# EAGLE design Unified 4.24.22 (EAGLE 9.6.2)

## Sheet 1 of 4
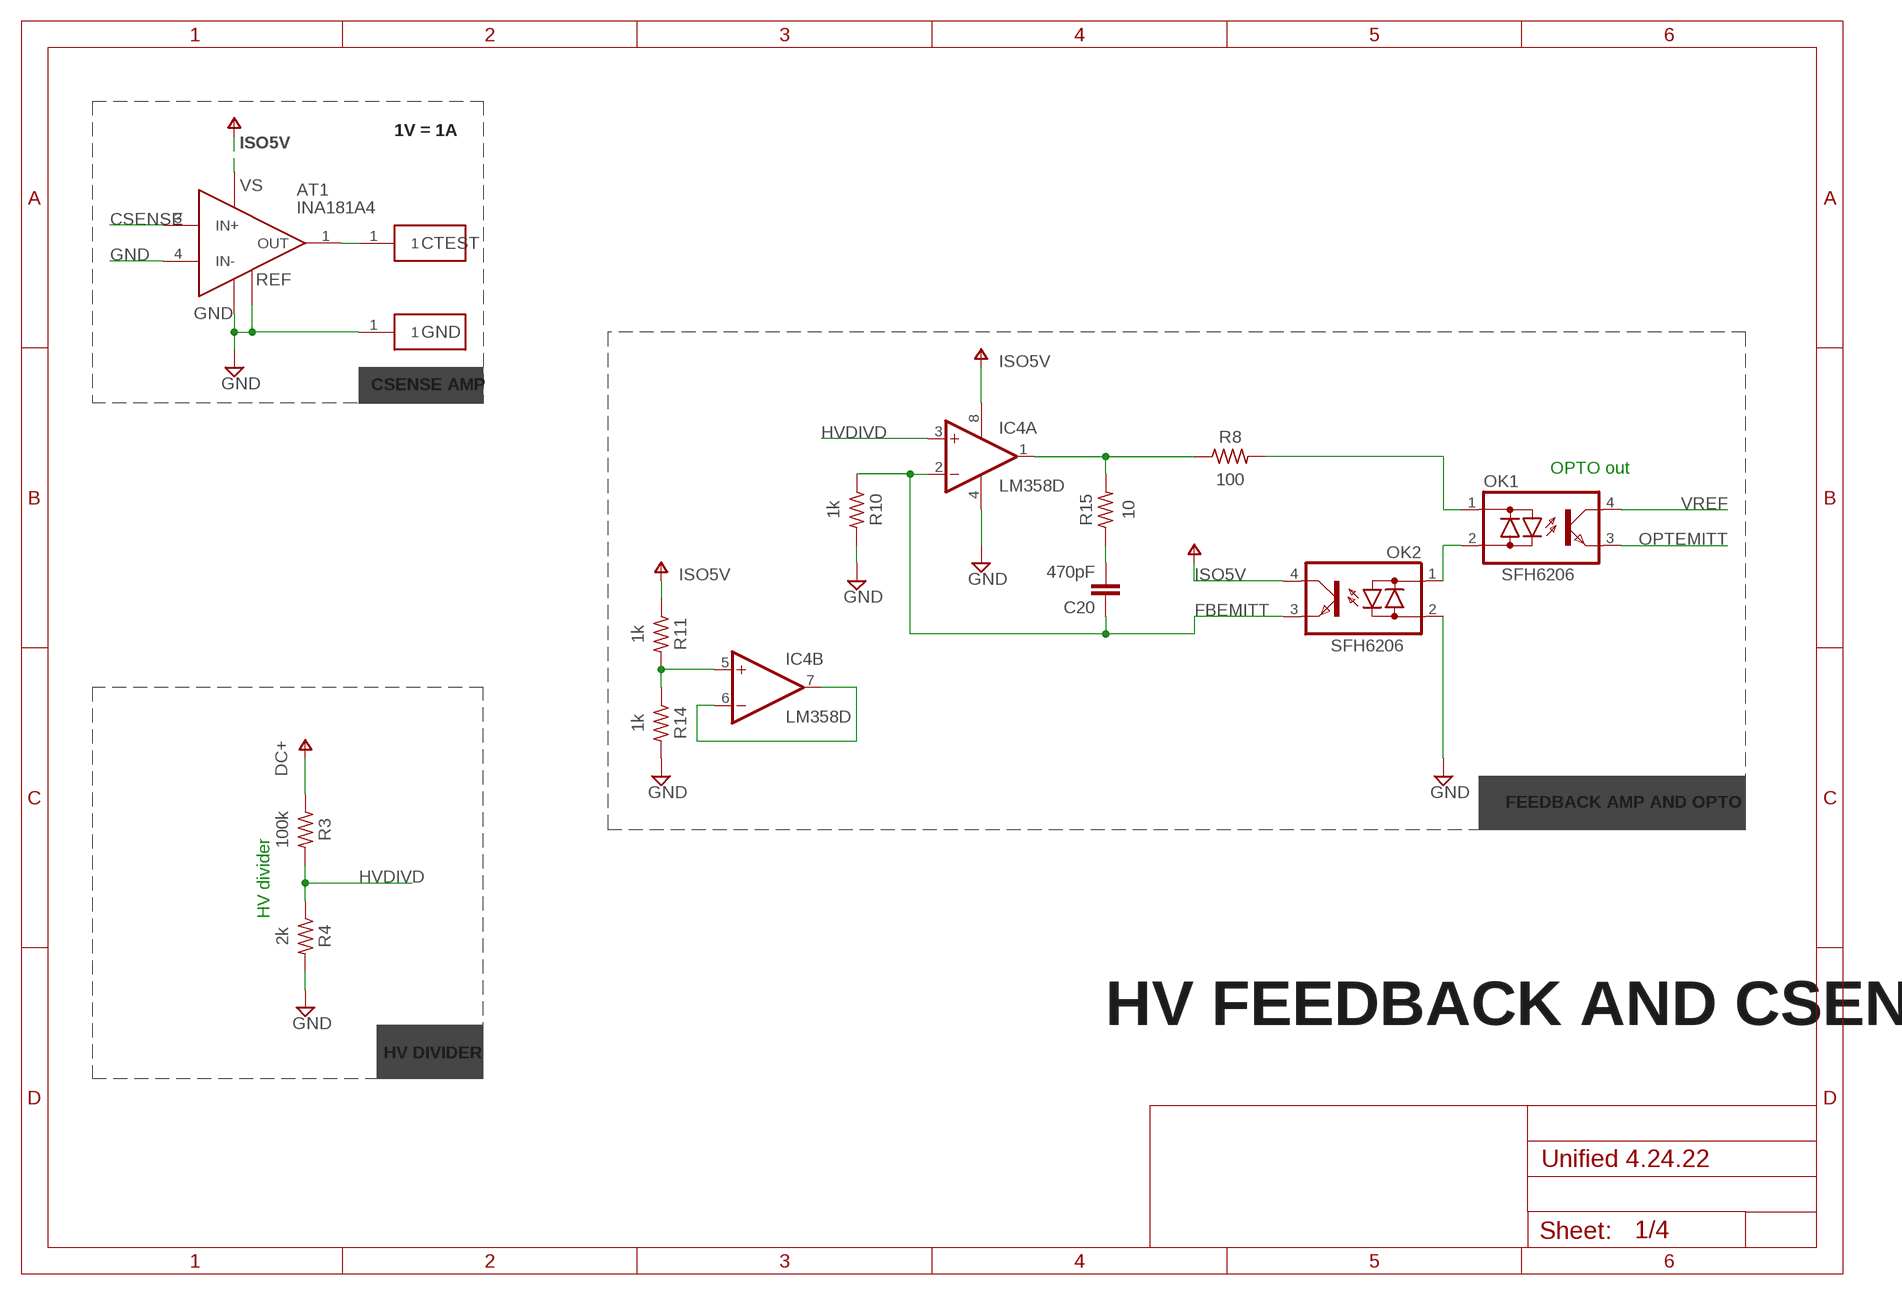
[diagram p0: schematic, sheet 1]

### Parts
AT1  INA181A4  INA181A3IDBVR  [SOT95P280X145-6N]
C20  470pF  C-EUC0805K  [C0805K]
CTEST  RCT-0C  [RCT-0C]
GND  RCT-0C  [RCT-0C]
IC4  LM358D  [SO08]
OK1  SFH6206  [DIL4-SMD]
OK2  SFH6206  [DIL4-SMD]
R3  100k  R-US_MELF0207R  [MINI_MELF-0207R]
R4  2k  R-US_R0805  [R0805]
R8  100  R-US_R0805  [R0805]
R10  1k  R-US_R0805  [R0805]
R11  1k  R-US_R0805  [R0805]
R14  1k  R-US_R0805  [R0805]
R15  10  R-US_R0805  [R0805]

### Nets
CSENSE: AT1.3(IN+) ; also sheet 2
DC+: R3.1 ; supply symbol labelled V+ ; also sheet 2
FBEMITT: C20.1 IC4.2(A:-IN) OK2.3(E) R10.1
GND: AT1.2(GND) AT1.4(IN-) AT1.5(REF) GND.1 IC4.4(P:V-) OK2.2(AC2) R4.2 R10.2 R14.2 ; also sheet 2,4
HVDIVD: IC4.3(A:+IN) R3.2 R4.1
ISO5V: AT1.6(VS) IC4.8(P:V+) OK2.4(C) R11.1 ; supply symbol labelled V+ ; also sheet 4
N$4: OK1.1(AC1) R8.2
N$6: OK1.2(AC2) OK2.1(AC1)
N$10: AT1.1(OUT) CTEST.1
N$18: IC4.5(B:+IN) R11.2 R14.1
N$20: IC4.1(A:OUT) R8.1 R15.2
N$21: IC4.6(B:-IN) IC4.7(B:OUT)
N$22: C20.2 R15.1
OPTEMITT: OK1.3(E) ; also sheet 3
VREF: OK1.4(C) ; also sheet 3

### Notes on the sheet
- 1V = 1A
- CSENSE AMP
- OPTO out
- FEEDBACK AMP AND OPTO
- HV divider
- HV FEEDBACK AND CSENSE
- HV DIVIDER

## Sheet 2 of 4
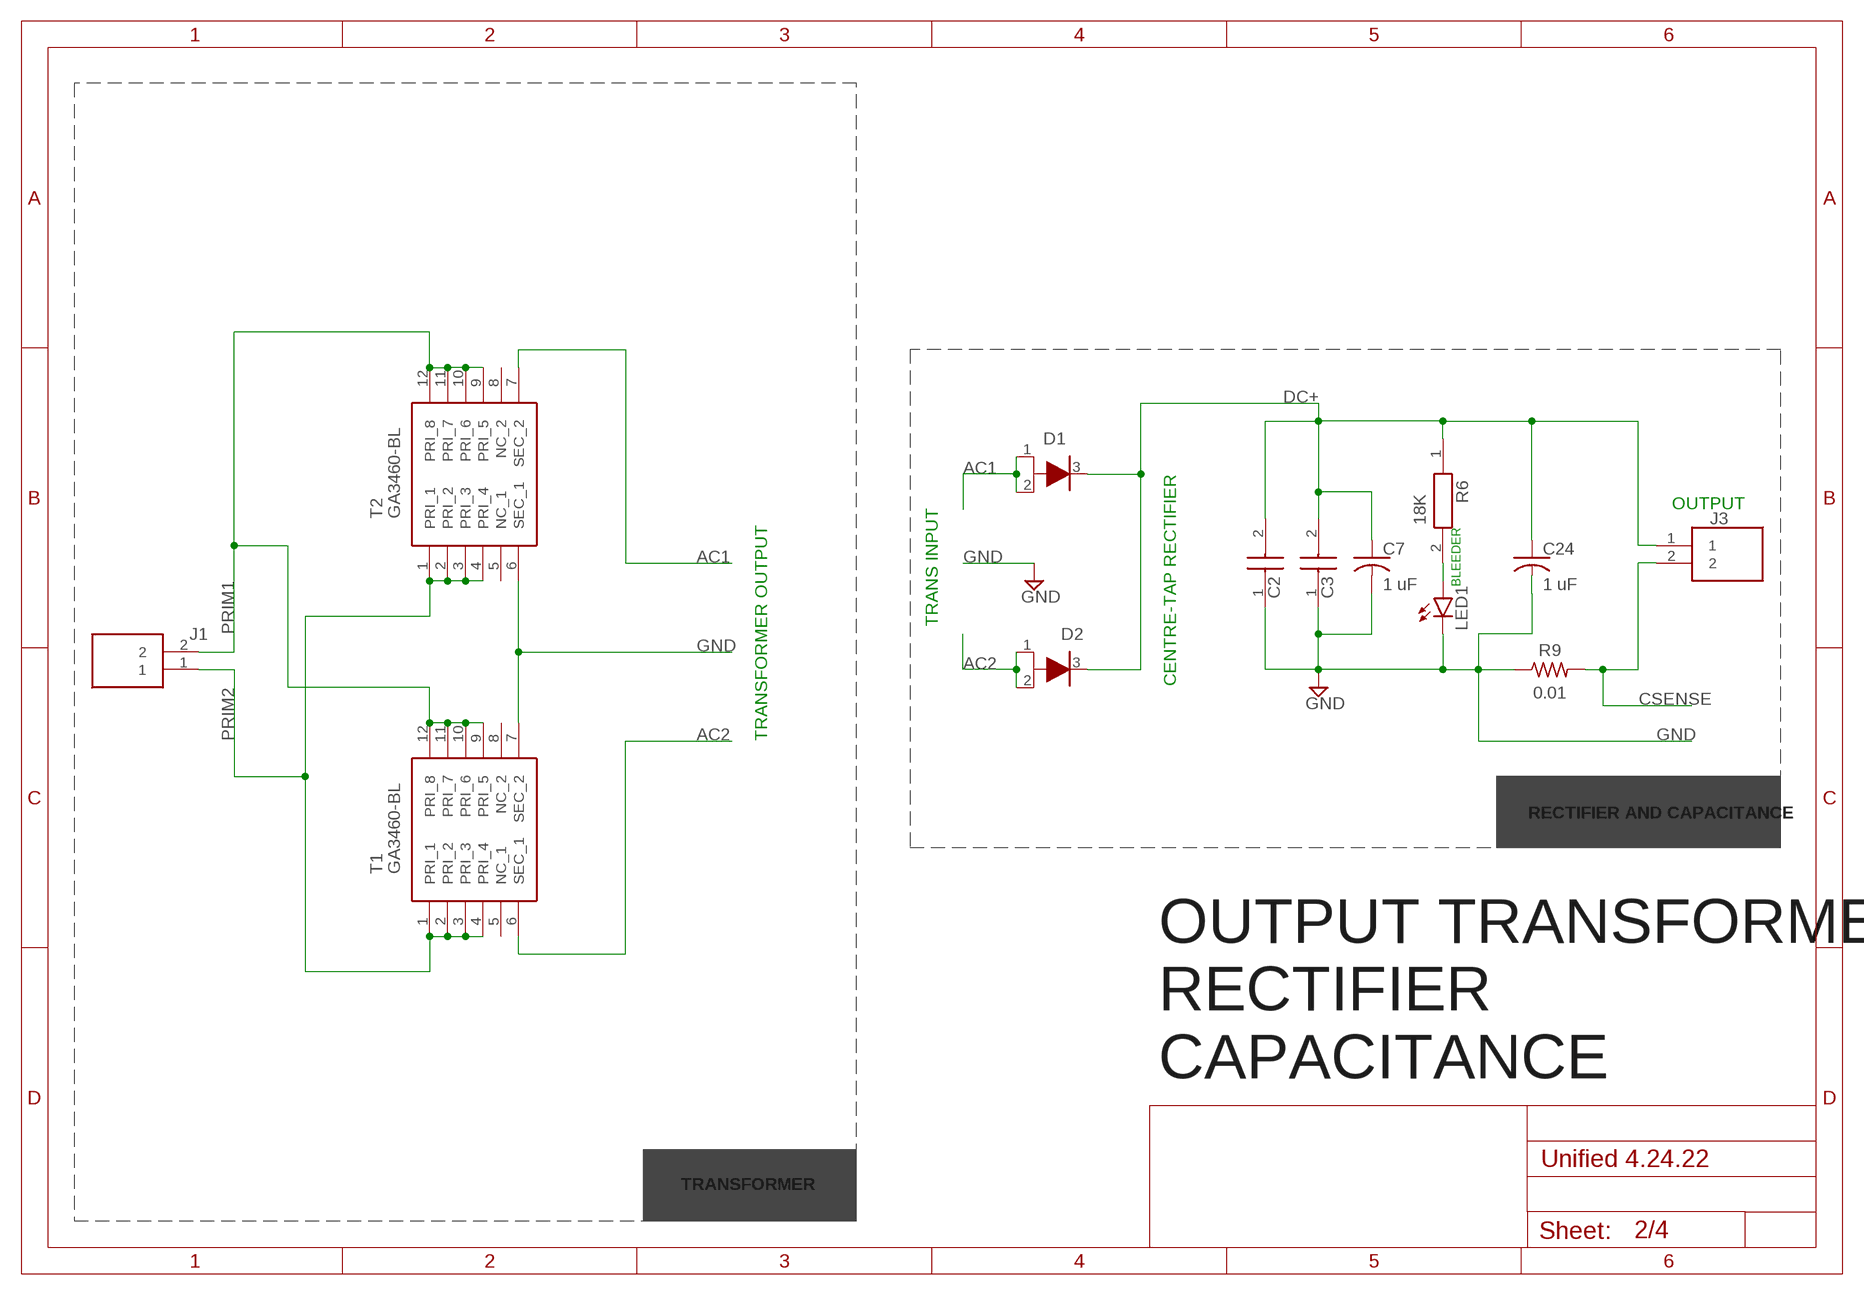
[diagram p1: schematic, sheet 2]

### Parts
C2  ELH227M400AS2AV  [CAPPRD1000W140D3000H3200]
C3  ELH227M400AS2AV  [CAPPRD1000W140D3000H3200]
C7  1 uF  C-USC1210K  [C1210K]
C24  1 uF  C-USC1210K  [C1210K]
D1  VS-16EDH02HM3_I  [V40DL45BPM3I]
D2  VS-16EDH02HM3_I  [V40DL45BPM3I]
J1  2305908-2  [23059082]
J3  2305908-2  [23059082]
LED1  LED5MM  [LED5MM]
R6  18K  MOS2CT52R183J  [RESAD3100W80L1500D400]
R9  0.01  R-US_CHIP-2512(6332-METRIC)  [RESC6332X71]
T1  GA3460-BL  [GA3460BL]
T2  GA3460-BL  [GA3460BL]

### Nets
AC1: D1.1(A_1) D1.2(A) T2.7(SEC_2)
AC2: D2.1(A_1) D2.2(A) T1.6(SEC_1)
CSENSE: J3.2 R9.2 ; also sheet 1
DC+: C2.2(-) C3.2(-) C7.1 C24.1 D1.3(K) D2.3(K) J3.1 R6.1 ; also sheet 1
GND: C2.1(+) C3.1(+) C7.2 C24.2 LED1.K(C) R9.1 T1.7(SEC_2) T2.6(SEC_1) ; also sheet 1,4
N$5: LED1.A R6.2
PRIM1: J1.2 T1.9(PRI_5) T1.10(PRI_6) T1.11(PRI_7) T1.12(PRI_8) T2.9(PRI_5) T2.10(PRI_6) T2.11(PRI_7) T2.12(PRI_8)
PRIM2: J1.1 T1.1(PRI_1) T1.2(PRI_2) T1.3(PRI_3) T1.4(PRI_4) T2.1(PRI_1) T2.2(PRI_2) T2.3(PRI_3) T2.4(PRI_4)
Unconnected: T1.5(NC_1) T1.8(NC_2) T2.5(NC_1) T2.8(NC_2)

### Notes on the sheet
- CENTRE-TAP RECTIFIER
- TRANS INPUT | OUTPUT
- BLEEDER
- TRANSFORMER OUTPUT
- RECTIFIER AND CAPACITANCE
- OUTPUT TRANSFORMER
  RECTIFIER
  CAPACITANCE
- TRANSFORMER

## Sheet 3 of 4
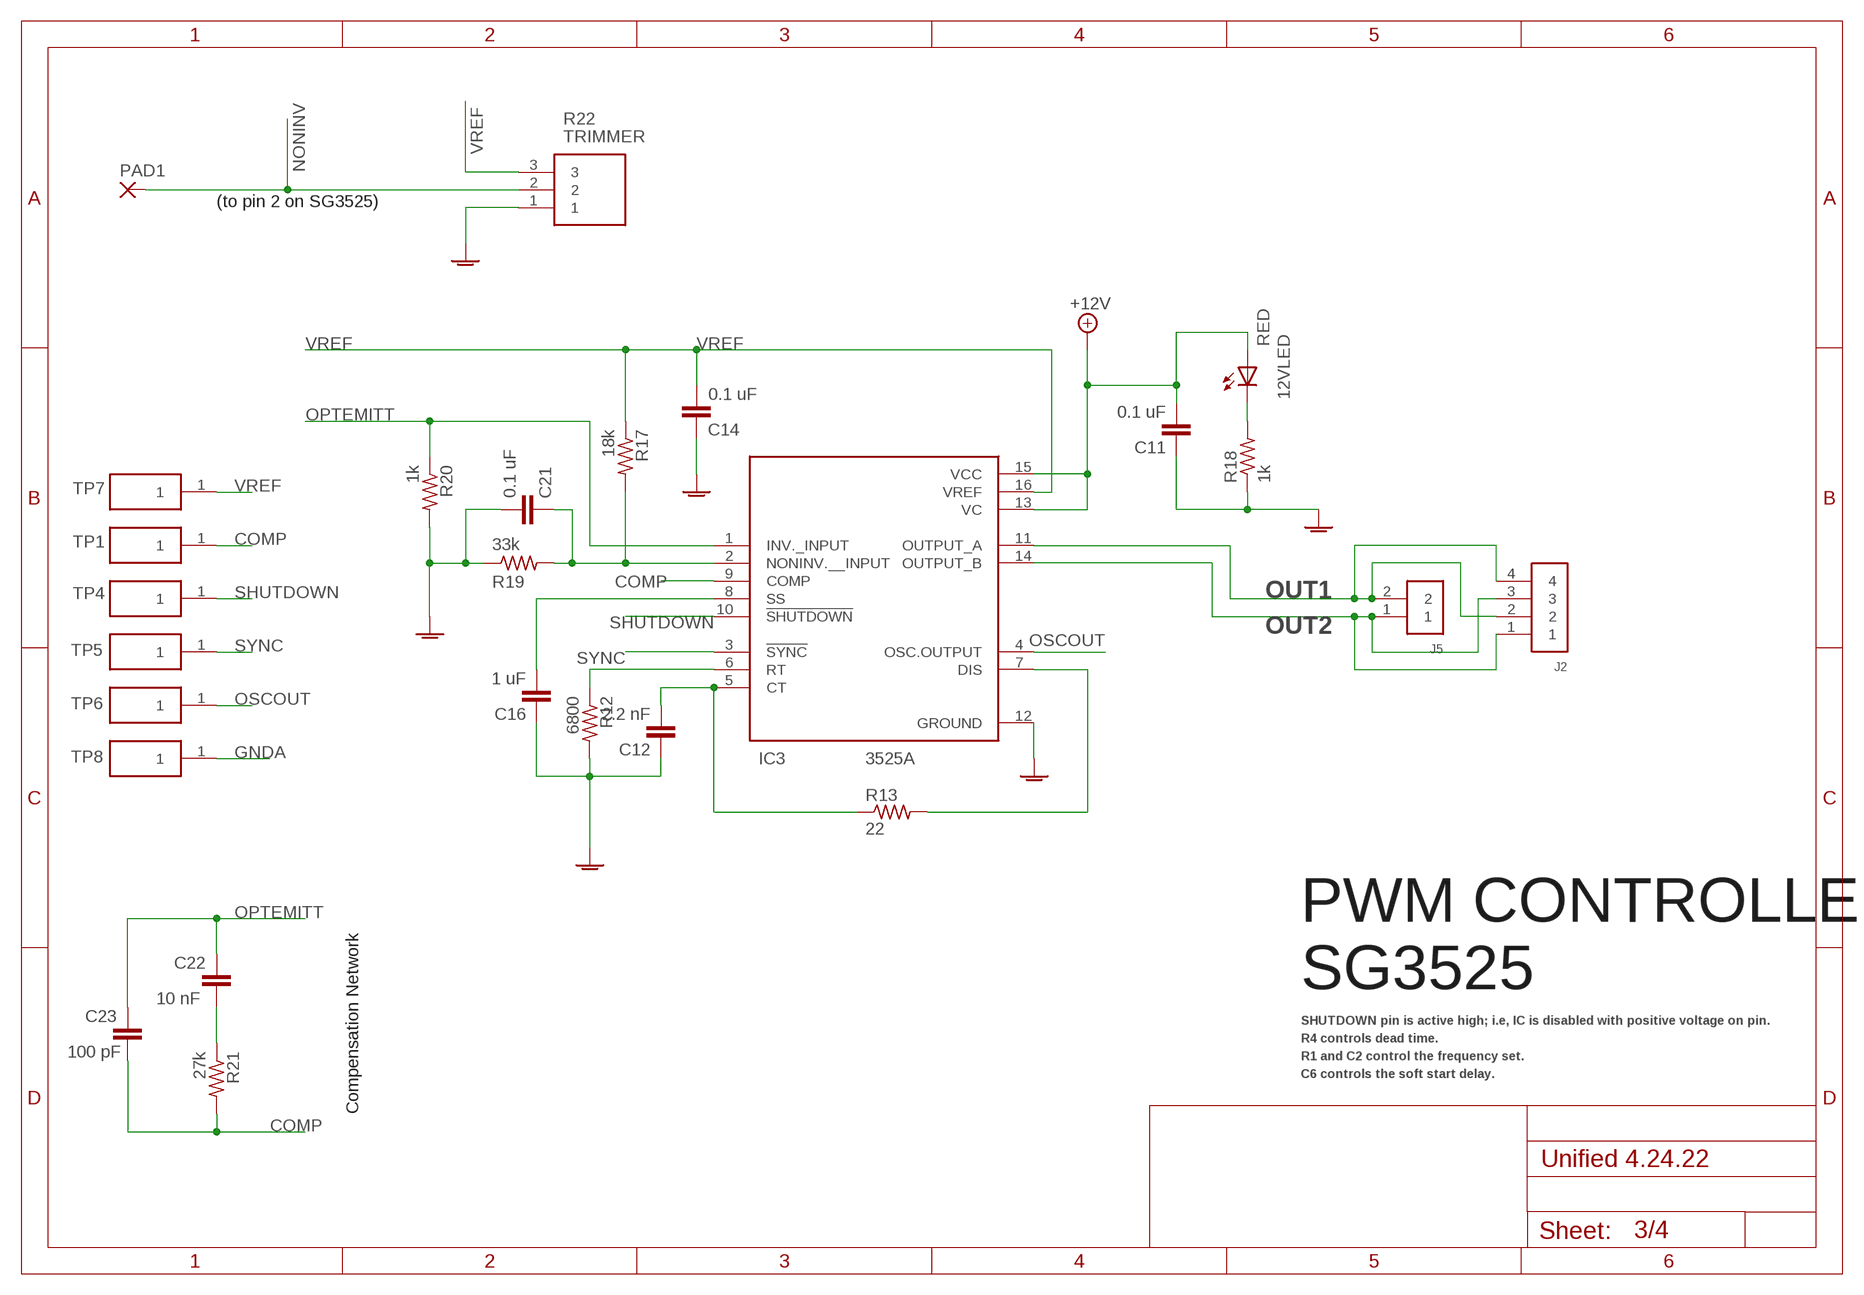
[diagram p2: schematic, sheet 3]

### Parts
12VLED  RED  LEDCHIPLED_0805  [CHIPLED_0805]
C11  0.1 uF  C-EUC0805K  [C0805K]
C12  2.2 nF  C-EUC0805K  [C0805K]
C14  0.1 uF  C-EUC0805K  [C0805K]
C16  1 uF  C-EUC0805K  [C0805K]
C21  0.1 uF  C-EUC0805K  [C0805K]
C22  10 nF  C-EUC0805K  [C0805K]
C23  100 pF  C-EUC0805K  [C0805K]
IC3  3525A  SG3525ADWR2G  [SOIC127P1030X265-16N]
J2  61300411121  [61300411121]
J5  61300211121  [61300211121]
PAD1  2,54/0,9  [2,54/0,9]
R12  6800  R-US_R0805  [R0805]
R13  22  R-US_R0805  [R0805]
R17  18k  R-US_R0805  [R0805]
R18  1k  R-US_R0805  [R0805]
R19  33k  R-US_R0805  [R0805]
R20  1k  R-US_R0805  [R0805]
R21  27k  R-US_R0805  [R0805]
R22  TRIMMER  PV36W203C01B00  [PV36W201C01B00]
TP1  RCT-0C  [RCT-0C]
TP4  RCT-0C  [RCT-0C]
TP5  RCT-0C  [RCT-0C]
TP6  RCT-0C  [RCT-0C]
TP7  RCT-0C  [RCT-0C]
TP8  RCT-0C  [RCT-0C]

### Nets
12V: 12VLED.A C11.2 IC3.13(VC) IC3.15(VCC) ; supply symbol labelled +12V ; also sheet 4
COMP: C23.2 IC3.9(COMP) R21.2 TP1.1
CT: C12.2 IC3.5(CT) R13.1
DISCHARG: IC3.7(DIS) R13.2
GNDA: C11.1 C12.1 C14.1 C16.1 C21.2 IC3.12(GROUND) R12.2 R18.1 R19.1 R20.2 R22.1 TP8.1 ; also sheet 4
N$17: 12VLED.C R18.2
N$25: C22.2 R21.1
NONINV: C21.1 IC3.2(NONINV.__INPUT) PAD1.1(P) R17.2 R19.2 R22.2
OPTEMITT: C22.1 C23.1 IC3.1(INV._INPUT) R20.1 ; also sheet 1
OSCOUT: IC3.4(OSC.OUTPUT) TP6.1
OUT1: IC3.11(OUTPUT_A) J2.2 J2.4 J5.2
OUT2: IC3.14(OUTPUT_B) J2.1 J2.3 J5.1
RT: IC3.6(RT) R12.1
SHUTDOWN: IC3.10(!SHUTDOWN) TP4.1
SOFTSTART: C16.2 IC3.8(SS)
SYNC: IC3.3(!SYNC) TP5.1
VREF: C14.2 IC3.16(VREF) R17.1 R22.3 TP7.1 ; also sheet 1

### Notes on the sheet
- (to pin 2 on SG3525)
- PWM CONTROLLER
  SG3525
- SHUTDOWN pin is active high; i.e, IC is disabled with positive voltage on pin.
- R4 controls dead time.
- R1 and C2 control the frequency set.
- C6 controls the soft start delay.
- Compensation Network

## Sheet 4 of 4
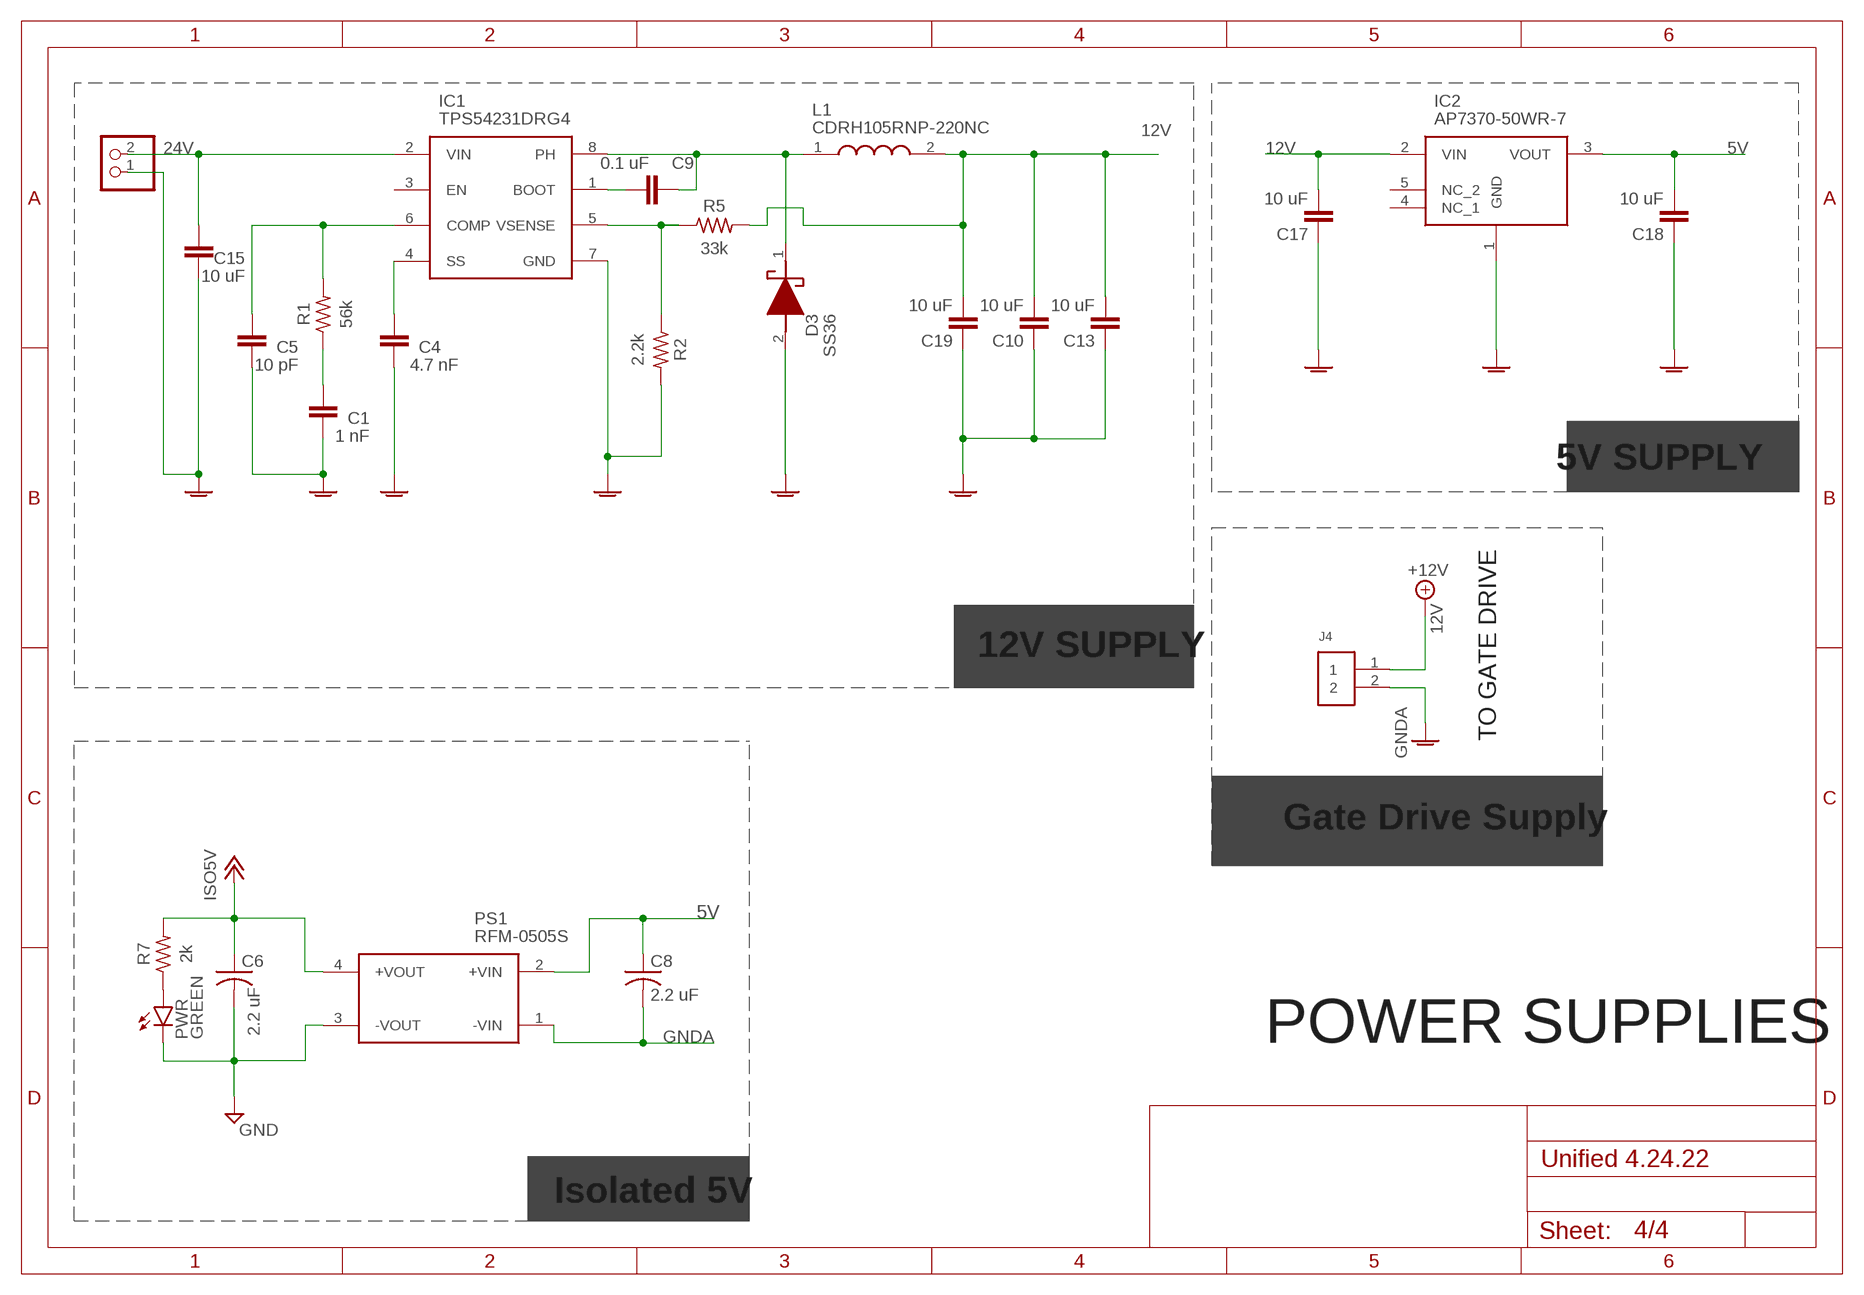
[diagram p3: schematic, sheet 4]

### Parts
C1  1 nF  C-EUC0805K  [C0805K]
C4  4.7 nF  C-EUC0805K  [C0805K]
C5  10 pF  C-EUC0805K  [C0805K]
C6  2.2 uF  C-USC0805  [C0805]
C8  2.2 uF  C-USC0805  [C0805]
C9  0.1 uF  C-EUC0805K  [C0805K]
C10  10 uF  C-EUC0805K  [C0805K]
C13  10 uF  C-EUC0805K  [C0805K]
C15  10 uF  C-EUC0805K  [C0805K]
C17  10 uF  C-EUC0805K  [C0805K]
C18  10 uF  C-EUC0805K  [C0805K]
C19  10 uF  C-EUC0805K  [C0805K]
D3  SS36  [DIOM8059X265N]
IC1  TPS54231DRG4  [SOIC127P600X175-8N]
IC2  AP7370-50WR-7  [SOT95P285X140-5N]
J4  61300211121  [61300211121]
L1  CDRH105RNP-220NC  [INDPM102100X510N]
PS1  RFM-0505S  [RFM0505S]
PWR  GREEN  LEDSML0805  [SML0805]
R1  56k  R-US_R0805  [R0805]
R2  2.2k  R-US_R0805  [R0805]
R5  33k  R-US_R0805  [R0805]
R7  2k  R-US_R0805  [R0805]
SUPPLY  PINHD-1X2  [1X02]

### Nets
5V: C8.1 C18.2 IC2.3(VOUT) PS1.2(+VIN)
12V: C10.2 C13.2 C17.2 C19.2 IC2.2(VIN) J4.1 L1.2 R5.2 ; supply symbol labelled +12V ; also sheet 3
24V: C15.2 IC1.2(VIN) SUPPLY.2
BOOT: C9.2 IC1.1(BOOT)
GND: C6.2 PS1.3(-VOUT) PWR.C ; also sheet 1,2
GNDA: C1.1 C4.1 C5.1 C8.2 C10.1 C13.1 C15.1 C17.1 C18.1 C19.1 D3.2(A) IC1.7(GND) IC2.1(GND) J4.2 PS1.1(-VIN) R2.2 SUPPLY.1 ; also sheet 3
ISO5V: C6.1 PS1.4(+VOUT) R7.2 ; supply symbol labelled +12V ; also sheet 1
N$1: PWR.A R7.1
N$8: C1.2 R1.1
SWITCH: C9.1 D3.1(K) IC1.8(PH) L1.1
TPCOMP: C5.2 IC1.6(COMP) R1.2
TPSS: C4.2 IC1.4(SS)
VSEN: IC1.5(VSENSE) R2.1 R5.1
Unconnected: IC1.3(EN) IC2.4(NC_1) IC2.5(NC_2)

### Notes on the sheet
- 5V SUPPLY
- 12V SUPPLY
- TO GATE DRIVE
- Gate Drive Supply
- POWER SUPPLIES
- Isolated 5V

## Library data of the parts
12VLED LED1 PWR = led:LED: LED OSRAM: - CHIPLED LG R971, LG N971, LY N971, LG Q971, LY Q971, LO R971, LY R971 LH N974, LH R974 LS Q976, LO Q976, LY Q976 LO Q996 - Hyper CHIPLED LW Q18S LB Q993, LB Q99A, LB R99A - SideLED LS A670, LO A670, LY A670, LG A670, LP A670 LB A673, LV A673, LT A673, LW A673 LH A674 LY A675 LS A676, LA A676, LO A676, LY A676, LW A676 LS A679, LY A679, LG A679 - Hyper Micro SIDELED® LS Y876, LA Y876, LO Y876, LY Y876 LT Y87S - SmartLED LW L88C, LW L88S LB L89C, LB L89S, LG L890 LS L89K, LO L89K, LY L89K LS L896, LA L896, LO L896, LY L896 - TOPLED LS T670, LO T670, LY T670, LG T670, LP T670 LSG T670, LSP T670, LSY T670, LOP T670, LYG T670 LG T671, LOG T671, LSG T671 LB T673, LV T673, LT T673, LW T673 LH T674 LS T676, LA T676, LO T676, LY T676, LB T676, LH T676, LSB T676, LW T676 LB T67C, LV T67C, LT T67C, LS T67K, LO T67K, LY T67K, LW E67C LS E67B, LA E67B, LO E67B, LY E67B, LB E67C, LV E67C, LT E67C LW T67C LS T679, LY T679, LG T679 LS T770, LO T770, LY T770, LG T770, LP T770 LB T773, LV T773, LT T773, LW T773 LH T774 LS E675, LA E675, LY E675, LS T675 LS T776, LA T776, LO T776, LY T776, LB T776 LHGB T686 LT T68C, LB T68C - Hyper Mini TOPLED® LB M676 - Mini TOPLED Santana® LG M470 LS M47K, LO M47K, LY M47K Source: http://www.osram.convergy.de LUXEON: - LUMILED® LXK2-PW12-R00, LXK2-PW12-S00, LXK2-PW14-U00, LXK2-PW14-V00 LXK2-PM12-R00, LXK2-PM12-S00, LXK2-PM14-U00 LXK2-PE12-Q00, LXK2-PE12-R00, LXK2-PE12-S00, LXK2-PE14-T00, LXK2-PE14-U00 LXK2-PB12-K00, LXK2-PB12-L00, LXK2-PB12-M00, LXK2-PB14-N00, LXK2-PB14-P00, LXK2-PB14-Q00 LXK2-PR12-L00, LXK2-PR12-M00, LXK2-PR14-Q00, LXK2-PR14-R00 LXK2-PD12-Q00, LXK2-PD12-R00, LXK2-PD12-S00 LXK2-PH12-R00, LXK2-PH12-S00 LXK2-PL12-P00, LXK2-PL12-Q00, LXK2-PL12-R00 Source: www.luxeon.com KINGBRIGHT: KA-3528ASYC Source: www.kingbright.com
AT1 = SamacSys_Parts:INA181A3IDBVR: Automotive, 26V bi-directional current sense amplifier for cost-sensitive systems Source: Datasheet <http://www.ti.com/lit/gpn/INA181>; DESCRIPTION: Automotive, 26V bi-directional current sense amplifier for cost-sensitive systems; HEIGHT: 1.45mm; MANUFACTURER_NAME: Texas Instruments; MANUFACTURER_PART_NUMBER: INA181A3IDBVR; MOUSER_PART_NUMBER: 595-INA181A3IDBVR; MOUSER_PRICE-STOCK: https://www.mouser.co.uk/ProductDetail/Texas-Instruments/INA181A3IDBVR?qs=5aG0NVq1C4xG8aOdRB7o5A%3D%3D
C1 = rcl:C-EU: CAPACITOR, European symbol; LCSC_PART: C1588
C2 C3 = SamacSys_Parts:ELH227M400AS2AV: Aluminum Electrolytic Capacitors - Snap In 400V 220uF 20% 85C Radial Source: Datasheet <https://www.kemet.com/specsheet/ELH227M400AS2AV>; DESCRIPTION: Aluminum Electrolytic Capacitors - Snap In 400V 220uF 20% 85C Radial; HEIGHT: 32mm; MANUFACTURER_NAME: Kemet; MANUFACTURER_PART_NUMBER: ELH227M400AS2AV; MOUSER_PART_NUMBER: 80-ELH227M400AS2AV; MOUSER_PRICE-STOCK: https://www.mouser.co.uk/ProductDetail/KEMET/ELH227M400AS2AV?qs=gt1LBUVyoHkpN%252BwKS%2FOtFw%3D%3D
C4 = rcl:C-EU: CAPACITOR, European symbol; LCSC_PART: C53987
C5 = rcl:C-EU: CAPACITOR, European symbol; LCSC_PART: C1785
C6 C8 = rcl:C-US: CAPACITOR, American symbol; LCSC_PART: C23630; SPICEPREFIX: C
C7 C24 = rcl:C-US: CAPACITOR, American symbol; SPICEPREFIX: C
C9 C14 C21 = rcl:C-EU: CAPACITOR, European symbol; LCSC_PART: C14663
C10 C13 C15 C17-C19 = rcl:C-EU: CAPACITOR, European symbol; LCSC_PART: C440198
C11 = rcl:C-EU: CAPACITOR, European symbol; LCSC_PART: C14663; SPICEPREFIX: C
C12 = rcl:C-EU: CAPACITOR, European symbol; LCSC_PART: C1604
C16 = rcl:C-EU: CAPACITOR, European symbol; LCSC_PART: C28323; SPICEPREFIX: C
C20 = rcl:C-EU: CAPACITOR, European symbol; LCSC_PART: C1743; SPICEPREFIX: C
C22 = rcl:C-EU: CAPACITOR, European symbol; LCSC_PART: C1710
C23 = rcl:C-EU: CAPACITOR, European symbol; LCSC_PART: C1790
CTEST GND TP1 TP4-TP8 = SamacSys_Parts:RCT-0C: TE CONNECTIVITY / CGS - RCT-0C - TEST POINT, 0805 CASE SIZE Source: Datasheet; DESCRIPTION: TE CONNECTIVITY / CGS - RCT-0C - TEST POINT, 0805 CASE SIZE; HEIGHT: mm; MANUFACTURER_NAME: TE Connectivity; MANUFACTURER_PART_NUMBER: RCT-0C; MOUSER_PART_NUMBER: 279-RCT-0C; MOUSER_PRICE-STOCK: https://www.mouser.co.uk/ProductDetail/TE-Connectivity-Holsworthy/RCT-0C?qs=ip69W3eHERWzZOsRKmFYAw%3D%3D
D1 D2 = SamacSys_Parts:VS-16EDH02HM3_I: VISHAY -VS-8ETH03S-M3 - RECTIFIER, 8A, 300V, TO-263AC Source: Datasheet <https://www.mouser.com/datasheet/2/427/VISH_S_A0007982235_1-2570276.pdf>; DESCRIPTION: VS-8ETH03S-M3 - RECTIFIER, 8A, 300V, TO-263; HEIGHT: 1mm; MANUFACTURER_NAME: Vishay; MANUFACTURER_PART_NUMBER: VS-8ETH03S-M3
D3 = SamacSys_Parts:SS36: ON SEMICONDUCTOR - SS36 - DIODE, SCHOTTKY, 3A, 60V, DO-214AB-3 Source: Datasheet <http://www.onsemi.com/pub/Collateral/SS39-D.PDF>; DESCRIPTION: ON SEMICONDUCTOR - SS36 - DIODE, SCHOTTKY, 3A, 60V, DO-214AB-3; HEIGHT: 2.65mm; MANUFACTURER_NAME: onsemi; MANUFACTURER_PART_NUMBER: SS36; MOUSER_PART_NUMBER: 512-SS36; MOUSER_PRICE-STOCK: https://www.mouser.co.uk/ProductDetail/ON-Semiconductor-Fairchild/SS36?qs=3wuez3jz59JyNj1can%252BtMw%3D%3D
IC1 = SamacSys_Parts:TPS54231DRG4: Conv DC-DC 3.5V to 28V Step Down Single-Out 0.8V to 25V 2A 8-Pin SOIC T/R Source: Datasheet <https://www.ti.com/lit/ds/slus851d/slus851d.pdf?ts=1636965384647&ref_url=https%3A%2F%2Fwww.google.com%2F>; DESCRIPTION: Conv DC-DC 3.5V to 28V Step Down Single-Out 0.8V to 25V 2A 8-Pin SOIC T/R; HEIGHT: 1.75mm; MANUFACTURER_NAME: Texas Instruments; MANUFACTURER_PART_NUMBER: TPS54231DRG4; MOUSER_PART_NUMBER: 595-TPS54231DRG4; MOUSER_PRICE-STOCK: https://www.mouser.co.uk/ProductDetail/Texas-Instruments/TPS54231DRG4?qs=drm0CCHqiV7vXa1NXkZ0ug%3D%3D
IC2 = SamacSys_Parts:AP7370-50WR-7: LDO Voltage Regulators LDO CMOS LowCurr SOT25 T&R 3K Source: Datasheet <https://www.diodes.com/assets/Datasheets/AP7370.pdf>; DESCRIPTION: LDO Voltage Regulators LDO CMOS LowCurr SOT25 T&R 3K; HEIGHT: 1.4mm; MANUFACTURER_NAME: Diodes Inc.; MANUFACTURER_PART_NUMBER: AP7370-50WR-7; MOUSER_PART_NUMBER: 621-AP7370-50WR-7; MOUSER_PRICE-STOCK: https://www.mouser.co.uk/ProductDetail/Diodes-Incorporated/AP7370-50WR-7?qs=%252B6g0mu59x7JfKR4dKVVRbQ%3D%3D
IC3 = SamacSys_Parts:SG3525ADWR2G: Pulse Width Modulator Control Circuit Source: Datasheet <http://www.onsemi.com/pub/Collateral/SG3525A-D.PDF>; DESCRIPTION: Pulse Width Modulator Control Circuit; HEIGHT: 2.65mm; MANUFACTURER_NAME: ON Semiconductor; MANUFACTURER_PART_NUMBER: SG3525ADWR2G; MOUSER_PART_NUMBER: 863-SG3525ADWR2G; MOUSER_PRICE-STOCK: https://www.mouser.co.uk/ProductDetail/onsemi/SG3525ADWR2G?qs=xZq1yRCsb1e5MX%2FZSmewFg%3D%3D
IC4 = linear:LM358: OP AMP also LM158; LM258; LM2904 Source: http://cache.national.com/ds/LM/LM158.pdf
J1 J3 = SamacSys_Parts:2305908-2: TE CONNECTIVITY / BUCHANAN - 2305908-2 - TERMINAL BLOCK, HEADER, 2POS, SMD Source: Datasheet <https://www.te.com/commerce/DocumentDelivery/DDEController?Action=srchrtrv&DocNm=1-1773930-3_BuchananWM_Brochure&DocType=Data Sheet&DocLang=English&PartCntxt=2305908-2&DocFormat=pdf>; DESCRIPTION: TE CONNECTIVITY / BUCHANAN - 2305908-2 - TERMINAL BLOCK, HEADER, 2POS, SMD; HEIGHT: 9mm; MANUFACTURER_NAME: TE Connectivity; MANUFACTURER_PART_NUMBER: 2305908-2; MOUSER_PART_NUMBER: 571-2305908-2; MOUSER_PRICE-STOCK: https://www.mouser.co.uk/ProductDetail/TE-Connectivity-Buchanan/2305908-2?qs=BZBei1rCqCB0kX75zk6ERQ%3D%3D
J2 = Headers:61300411121: CONN HEADER VERT 4POS 2.54MM Manufacturer's datasheet <https://katalog.we-online.de/em/datasheet/6130xx11121.pdf>; CREATED_BY: PCBLayout.com; DIGI_KEY_PART_NUMBER: 732-5317-ND; MANUFACTURER: Wurth Electronics Inc.; MPN: 61300411121
J4 J5 = Headers:61300211121: CONN HEADER VERT 2POS 2.54MM Manufacturer's datasheet <https://katalog.we-online.de/em/datasheet/6130xx11121.pdf>; CREATED_BY: PCBLayout.com; DIGI_KEY_PART_NUMBER: 732-5315-ND; MANUFACTURER: Wurth Electronics Inc.; MPN: 61300211121
L1 = SamacSys_Parts:CDRH105RNP-220NC: Fixed Inductors 22uH 2.9A 30% SMD LP INDUCTOR Source: Datasheet <https://componentsearchengine.com/Datasheets/1/CDRH105RNP-220NC.pdf>; DESCRIPTION: Fixed Inductors 22uH 2.9A 30% SMD LP INDUCTOR; HEIGHT: 5.1mm; LCSC_PART: C225030; MANUFACTURER_NAME: Sumida; MANUFACTURER_PART_NUMBER: CDRH105RNP-220NC; MOUSER_PART_NUMBER: 851-CDRH105RNP-220NC; MOUSER_PRICE-STOCK: https://www.mouser.co.uk/ProductDetail/Sumida/CDRH105RNP-220NC?qs=yEEOfDmvQDUZDnF6uS%2FNyg%3D%3D
OK1 OK2 = optocoupler:SFH620: Optocoupler, Phototransistor Output, AC Input Source: http://www.vishay.com/docs/83675/sfh620.pdf; MF: VISHAY/TELEFUNKEN; MPN: SFH6206-3; OC_FARNELL: 1469585; OC_NEWARK: 58K2214
PAD1 = wirepad:2,54/0,9: THROUGH-HOLE PAD
PS1 = SamacSys_Parts:RFM-0505S: RECOM POWER - RFM-0505S - DC-DC CONVERTER, 5V, 0.2A Source: Datasheet <https://www.recom-power.com/pdf/Econoline/RFM.pdf>; DESCRIPTION: RECOM POWER - RFM-0505S - DC-DC CONVERTER, 5V, 0.2A; HEIGHT: 10.5mm; MANUFACTURER_NAME: RECOM Power; MANUFACTURER_PART_NUMBER: RFM-0505S; MOUSER_PART_NUMBER: 919-RFM-0505S; MOUSER_PRICE-STOCK: https://www.mouser.co.uk/ProductDetail/RECOM-Power/RFM-0505S?qs=lYGu3FyN48dRVYKTH5ipqg%3D%3D
R1-R5 R7 R8 R10 R11 R14 R15 = rcl:R-US_: RESISTOR, American symbol; SPICEPREFIX: R
R6 = SamacSys_Parts:MOS2CT52R183J: Metal Oxide Resistors 2W 18K 5% Source: Datasheet; DESCRIPTION: Metal Oxide Resistors 2W 18K 5%; HEIGHT: mm; MANUFACTURER_NAME: KOA Speer; MANUFACTURER_PART_NUMBER: MOS2CT52R183J
R9 = Resistor:R-US: Resistor Fixed - ANSI; CATEGORY: Resistor; SUB-CATEGORY: Fixed
R12 = rcl:R-US_: RESISTOR, American symbol; LCSC_PART: C17772
R13 = rcl:R-US_: RESISTOR, American symbol; LCSC_PART: C17561
R17 = rcl:R-US_: RESISTOR, American symbol; LCSC_PART: C17506
R18 R20 = rcl:R-US_: RESISTOR, American symbol; LCSC_PART: C17513
R19 = rcl:R-US_: RESISTOR, American symbol; LCSC_PART: C17633
R21 = rcl:R-US_: RESISTOR, American symbol; LCSC_PART: C17593
R22 = SamacSys_Parts:PV36W203C01B00: Trimmer Resistors - Through Hole 20Kohms 10mm Square 25turn Source: Datasheet <http://www.bourns.com/docs/Product-Datasheets/pv36.pdf>; DESCRIPTION: Trimmer Resistors - Through Hole 20Kohms 10mm Square 25turn; HEIGHT: 10.03mm; MANUFACTURER_NAME: Bourns; MANUFACTURER_PART_NUMBER: PV36W203C01B00; MOUSER_PART_NUMBER: 81-PV36W203C01B00; MOUSER_PRICE-STOCK: https://www.mouser.co.uk/ProductDetail/Bourns/PV36W203C01B00?qs=ifmdR88tEJ99ema2C36ddg%3D%3D
SUPPLY = pinhead:PINHD-1X2: PIN HEADER
T1 T2 = SamacSys_Parts:GA3460-BL: Audio Transformers / Signal Transformers GA3460 for LT3751 500V 50A Source: Datasheet <https://componentsearchengine.com/Datasheets/1/GA3460-BL.pdf>; DESCRIPTION: Audio Transformers / Signal Transformers GA3460 for LT3751 500V 50A; HEIGHT: 14mm; MANUFACTURER_NAME: COILCRAFT; MANUFACTURER_PART_NUMBER: GA3460-BL; MOUSER_PART_NUMBER: 994-GA3460-BL; MOUSER_PRICE-STOCK: https://www.mouser.co.uk/ProductDetail/Coilcraft/GA3460-BL?qs=ZYnrCdKdyeeqpRItZMyzHA%3D%3D

## Board
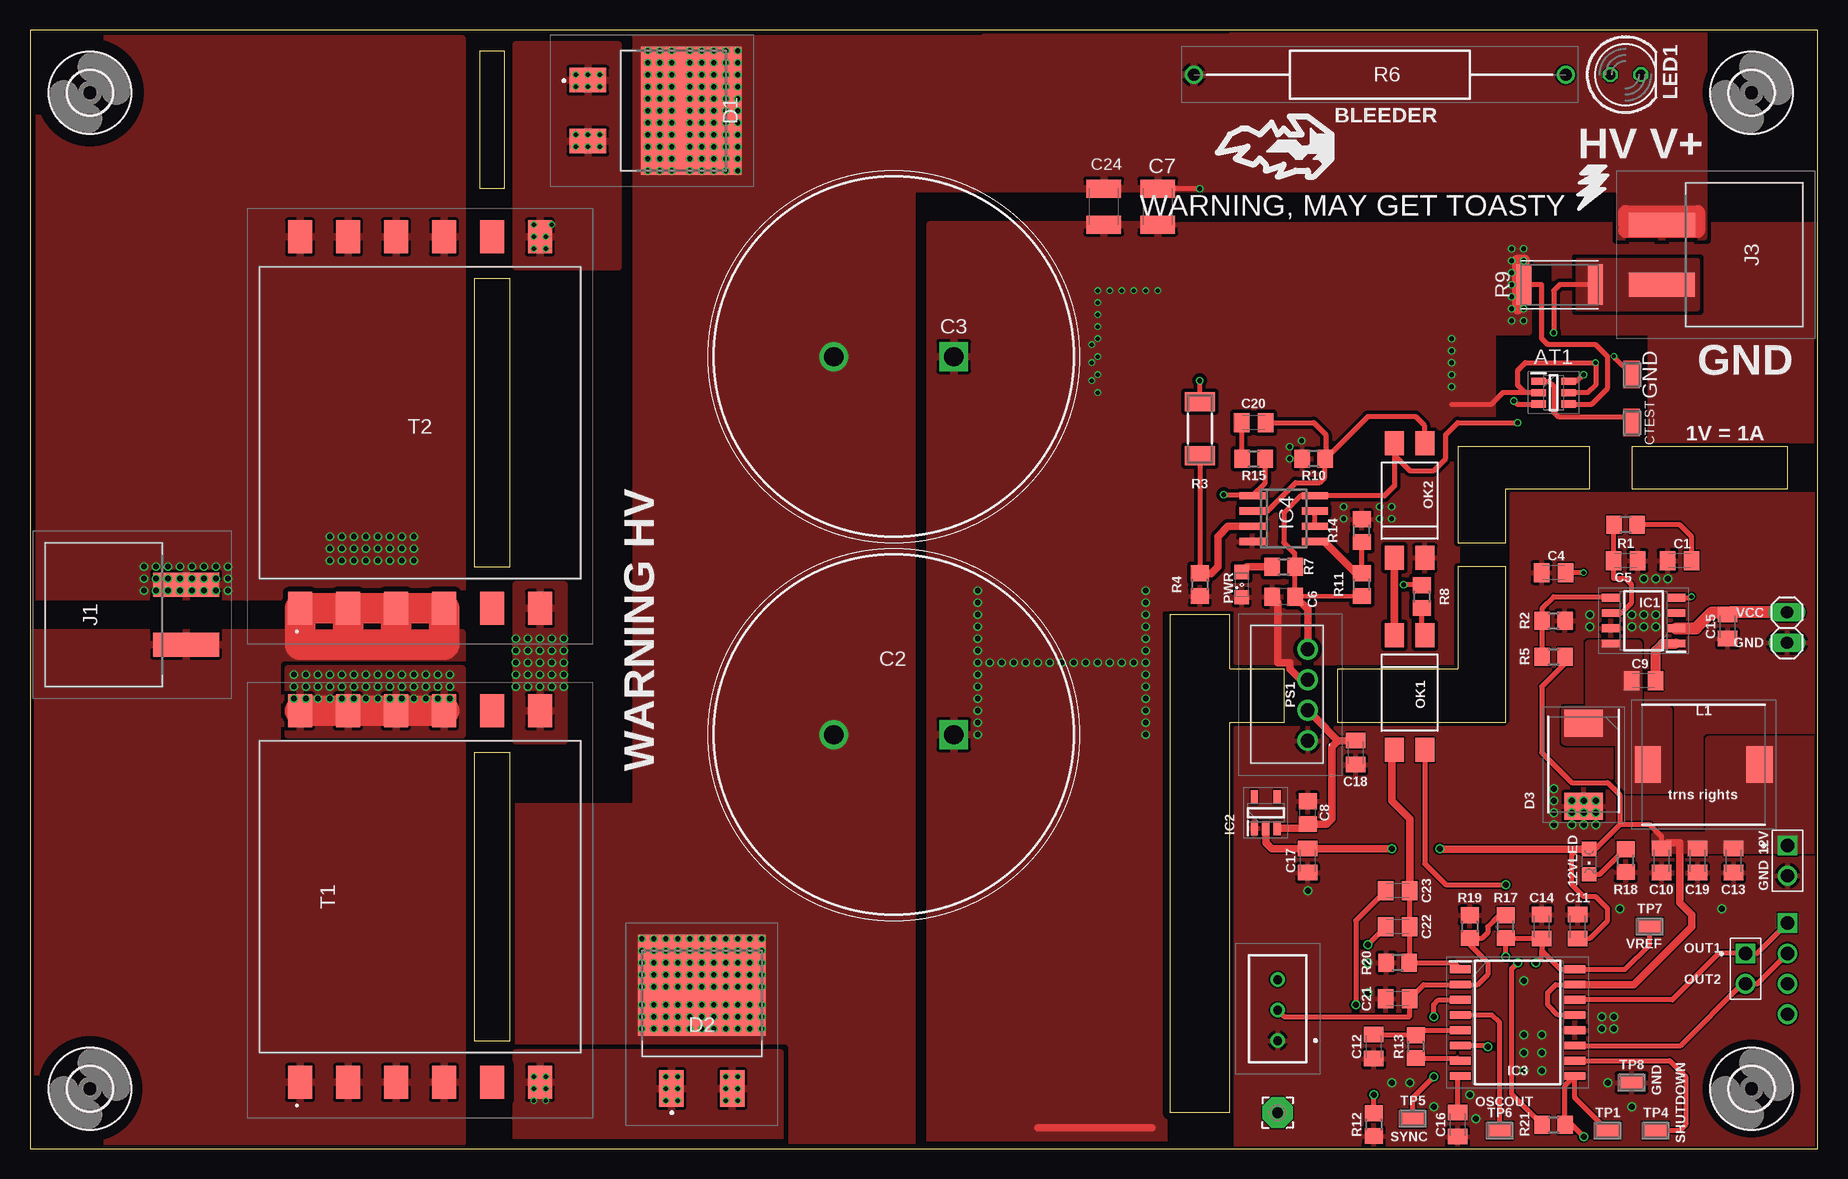
[diagram p4: board, top side]
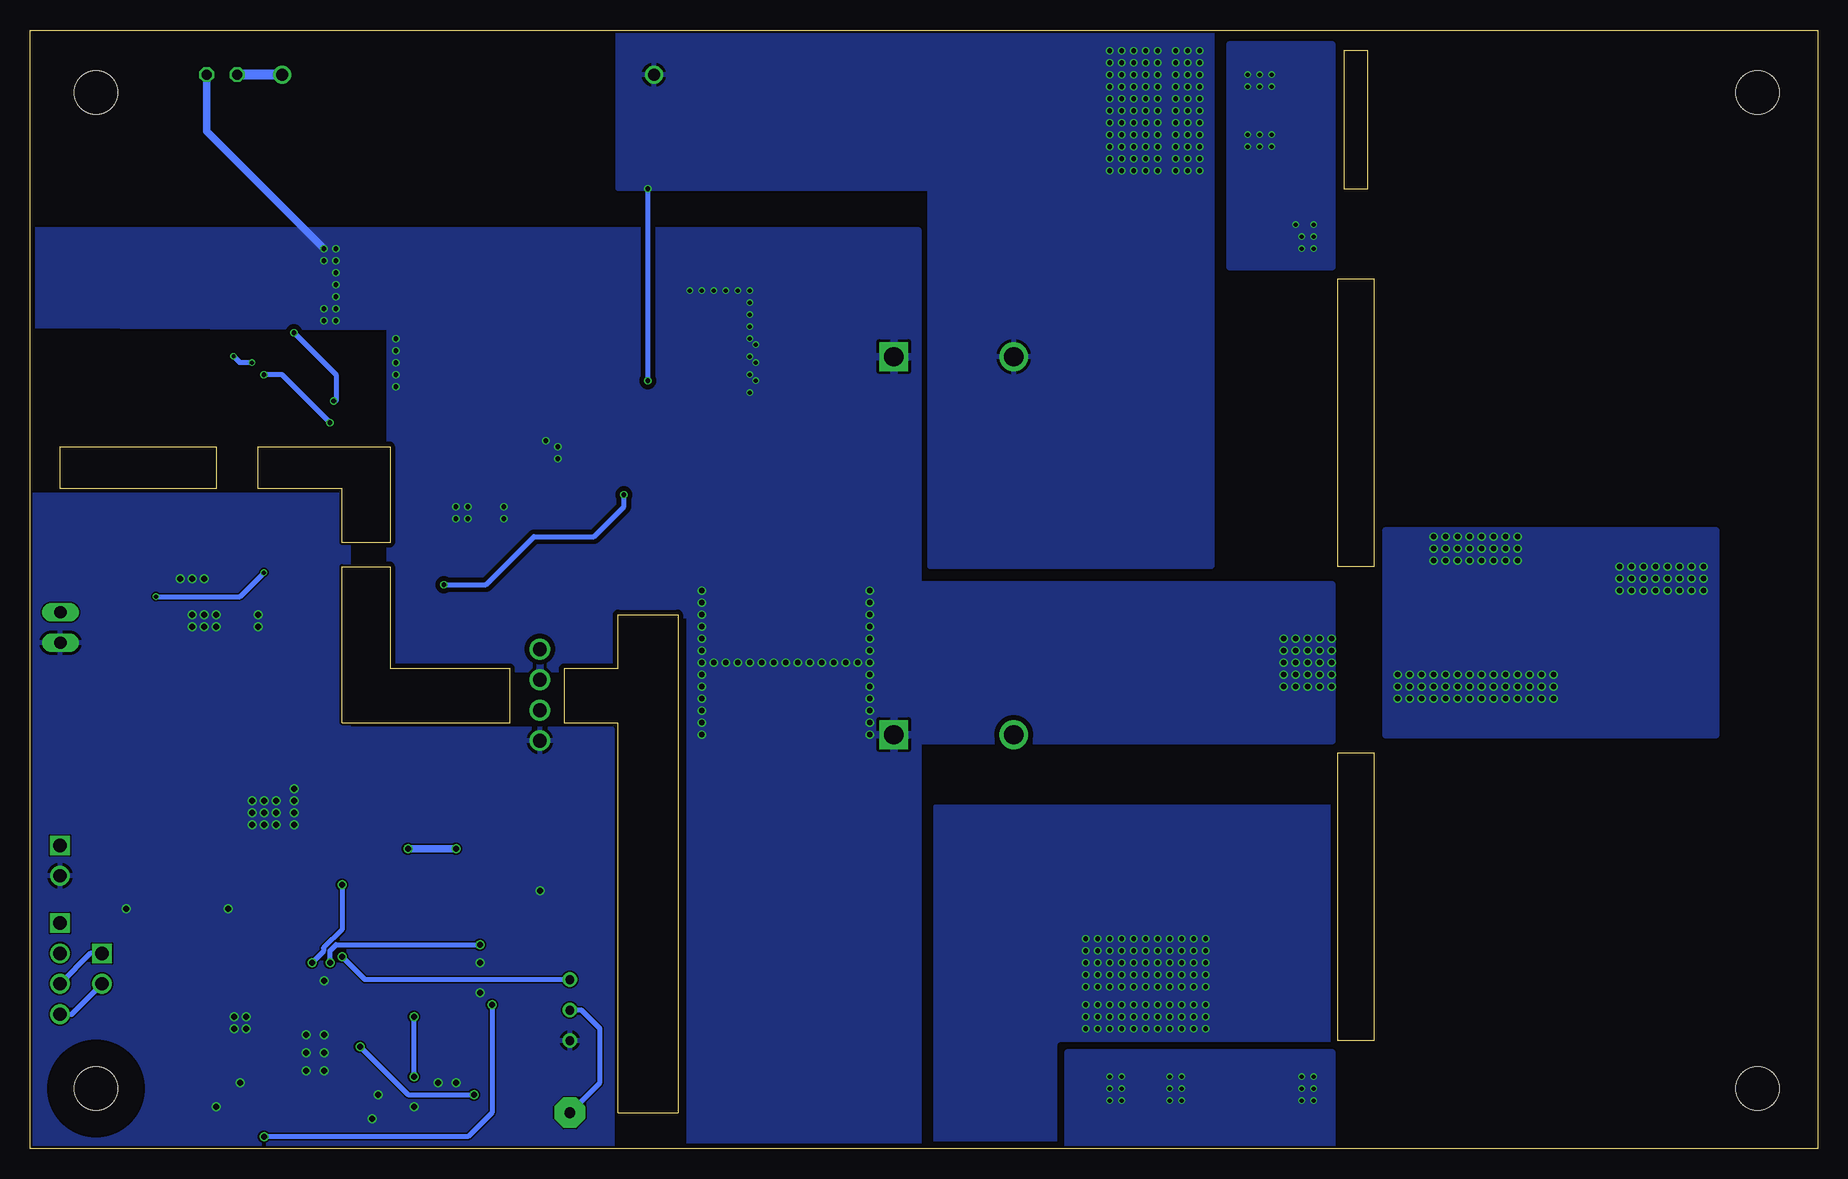
[diagram p5: board, bottom side, seen from below]

Size 149 x 93.22 mm. Coordinates in mm from the lower left corner, seen from the top.
Outline: 0,0 149,0 149,93.22 0,93.22 0,0
Outline: 100,3 100,35.5 104.5,35.5 104.5,40 100,40 100,44.5 95,44.5 95,3 100,3
Outline: 37,9 40,9 40,33 37,33 37,9
Outline: 37,48.5 40,48.5 40,72.5 37,72.5 37,48.5
Outline: 39.5,80 37.5,80 37.5,91.5 39.5,91.5 39.5,80
Outline: 109,40 119,40 119,48.5 123,48.5 123,35.5 109,35.5 109,40
Outline: 123,50.5 123,55 130,55 130,58.5 119,58.5 119,50.5 123,50.5
Outline: 133.5,58.5 133.5,55 146.5,55 146.5,58.5 133.5,58.5
Copper layers (1*16): Top 0.035559375mm / dielectric 1.6mm / Bottom 0.035559375mm
Design rules "jlcpcb2layer *": minimum track width 5mil, minimum drill 12mil, track to track 5mil, track to pad 5mil, pad to pad 5mil, via to via 5mil, smd to smd 5mil, copper to edge 8mil, drill to drill 6mil, minimum pad ring 5mil, minimum via ring 3mil, stop-mask expansion 2.5mil, vias tented up to drill 20mil, thermal gap 10mil

### Footprints (pad centres in the part's own frame; a part is rotated, then mirrored left to right if it is on the bottom)
CHIPLED_0805 = smd 1.2 x 1.2: A 0,-1.05; C 0,1.05
SOT95P280X145-6N = smd 1.2 x 0.6: 1 -1.25,0.95; 2 -1.25,0; 3 -1.25,-0.95; 4 1.25,-0.95; 5 1.25,0; 6 1.25,0.95
C0805K = smd 1.3 x 1.6: 1 -1,0; 2 1,0
CAPPRD1000W140D3000H3200 = drill 1.6 pad 2.4 square: 1 0,0 | drill 1.6 pad 2.4: 2 10,0
C0805 = smd 1.3 x 1.5: 1 -0.95,0; 2 0.95,0
C1210K = smd 1.5 x 2.9: 1 -1.5,0; 2 1.5,0
RCT-0C = smd 2.3 x 1.4: 1 0,0
V40DL45BPM3I = smd 2.03 x 3.05: 1 -2.54,-11.5; 2 2.54,-11.5 | smd 10.66 x 8.38: 3 0,-2.885
DIOM8059X265N = smd 2.25 x 3.2: 1 -3.45,0; 2 3.45,0
SOIC127P600X175-8N = smd 1.528 x 0.65: 1 -2.711,1.905; 2 -2.711,0.635; 3 -2.711,-0.635; 4 -2.711,-1.905; 5 2.711,-1.905; 6 2.711,-0.635; 7 2.711,0.635; 8 2.711,1.905
SOT95P285X140-5N = smd 1.15 x 0.6: 1 -1.3,0.95; 2 -1.3,0; 3 -1.3,-0.95; 4 1.3,-0.95; 5 1.3,0.95
SOIC127P1030X265-16N = smd 1.75 x 0.65: 1 -4.775,4.445; 2 -4.775,3.175; 3 -4.775,1.905; 4 -4.775,0.635; 5 -4.775,-0.635; 6 -4.775,-1.905; 7 -4.775,-3.175; 8 -4.775,-4.445; 9 4.775,-4.445; 10 4.775,-3.175; 11 4.775,-1.905; 12 4.775,-0.635; 13 4.775,0.635; 14 4.775,1.905; 15 4.775,3.175; 16 4.775,4.445
SO08 = smd 0.6 x 2.2: 1 -1.905,-2.6; 2 -0.635,-2.6; 3 0.635,-2.6; 4 1.905,-2.6; 5 1.905,2.6; 6 0.635,2.6; 7 -0.635,2.6; 8 -1.905,2.6
23059082 = smd 2 x 5.5: 1 -2.5,-4.5; 2 2.5,-4.5
61300411121 = drill 1.1 square: 1 -3.81,0 | drill 1.1: 2 -1.27,0; 3 1.27,0; 4 3.81,0
61300211121 = drill 1.1 square: 1 -1.27,0 | drill 1.1: 2 1.27,0
INDPM102100X510N = smd 2.2 x 3.05: 1 -4.65,0; 2 4.65,0
LED5MM = drill 0.813 octagon: A -1.27,0; K 1.27,0
DIL4-SMD = smd 1.6 x 2: 1 -1.27,-4.77; 2 1.27,-4.77; 3 1.27,4.77; 4 -1.27,4.77
2,54/0,9 = drill 0.914 pad 2.54 octagon: 1 0,0
RFM0505S = drill 1.15 pad 1.725: 1 0,0; 2 2.54,0; 3 5.08,0; 4 7.62,0
SML0805 = smd 1.2 x 1.2: A 1.05,0; C -1.05,0
R0805 = smd 1.3 x 1.5: 1 -0.95,0; 2 0.95,0
MINI_MELF-0207R = smd 1.6 x 2.5: 1 -2.25,0; 2 2.25,0
RESAD3100W80L1500D400 = drill 1 pad 1.5: 1 0,0; 2 31,0
RESC6332X71 = smd 1.231 x 3.37: 1 -2.97,0; 2 2.97,0
PV36W201C01B00 = drill 0.74 pad 1.2: 1 0,0; 2 0,2.54; 3 0,5.08
1X02 = drill 1.016 long: 1 -1.27,0; 2 1.27,0
GA3460BL = smd 2 x 2.75: 1 -10,-15.475; 2 -6,-15.475; 3 -2,-15.475; 4 2,-15.475; 5 6,-15.475; 6 10,-15.475; 7 10,15.475; 8 6,15.475; 9 2,15.475; 10 -2,15.475; 11 -6,15.475; 12 -10,15.475
3,6 = hole 3.6: 0,0

### Placement (x,y rotation side)
12VLED  129.96,23.92 180 top
AT1  127,63 0 top
C1  137.5,49 0 top
C2  77,34.5 180 top
C3  77,66 180 top
C4  127,48 0 top
C5  133,49 180 top
C6  104.5,46 180 top
C7  94,78.5 270 top
C8  106.5,28 90 top
C9  134.5,39 0 top
C10  136,24 90 top
C11  129,18.5 270 top
C12  112,8.5 90 top
C13  142,24 90 top
C14  126,18.5 270 top
C15  141.5,43.5 90 top
C16  119,2 90 top
C17  106.5,24 90 top
C18  110.5,33 90 top
C19  139,24 90 top
C20  102,60.5 180 top
C21  114,12.5 180 top
C22  114,18.5 180 top
C23  114,21.5 180 top
C24  89.5,78.5 270 top
CTEST  133.5,60.5 270 top
D1  58,86.5 270 top
D2  56,16.5 0 top
D3  129.5,32 270 top
GND  133.5,64.5 270 top
IC1  134.5,44 180 top
IC2  103,28 90 top
IC3  124,10.5 0 top
IC4  104.5,52.5 270 top
J1  8.5,44.5 90 top
J2  146.5,15 270 top
J3  140.5,74.5 270 top
J4  146.5,24 270 top
J5  143,15 270 top
L1  139.5,32 0 top
LED1  133,89.5 0 top
OK1  115,38 180 top
OK2  115,54 0 top
PAD1  104,3 90 top
PS1  106.5,34 90 top
PWR  101,47 90 top
R1  133,52 180 top
R2  127,44 0 top
R3  97.5,60 270 top
R4  97.5,47 270 top
R5  127,41 0 top
R6  97,89.5 0 top
R7  104.5,48.5 0 top
R8  116,46 270 top
R9  127.5,72 0 top
R10  107,57.5 180 top
R11  111,47 90 top
R12  112,2 270 top
R13  115.5,8.5 270 top
R14  111,51.5 90 top
R15  102,57.5 0 top
R17  123,18.5 90 top
R18  133,24 90 top
R19  120,18.5 270 top
R20  114,15.5 180 top
R21  127,2 0 top
R22  104,9 0 top
SUPPLY  146.46,43.42 90 top
T1  32.5,21 0 top
T2  32.5,60.5 0 top
TP1  131.5,1.5 0 top
TP4  135.5,1.5 0 top
TP5  115.25,2.5 0 top
TP6  122.5,1.5 0 top
TP7  135,18.5 0 top
TP8  133.5,5.5 0 top
U$1  [3,6]  5,5 0 top
U$2  [3,6]  5,88 0 top
U$3  [3,6]  143.5,88 0 top
U$4  [3,6]  143.5,5 0 top

### Tracks (layer width: path | path; a pad name or v marks a point on that pad's centre or on a via)
5V
  Top 0.61: IC2.3 106.15,26.7 C8.1 108.05,27.05 108.5,27.5 108.5,33.5 109,34 | 109,34 C18.2 | PS1.2 108,35.04 108,35 109,34
12V  (via drill 0.5)
  Top 0.406: R5.2 127.92,40.42 126,38.5 126,33 128.5,30.5 131.5,30.5 132.5,29.5 132.5,27 | 132.5,27 130.47,24.97 12VLED.A 129.93,25 129,25 128.5,24.5 128.5,22 129.5,21 130.5,21 131.5,20 131.5,19 130.05,17.55 C11.2 | C10.2 136,26 135,27 132.5,27 | IC3.13 127.36,11.13 126.5,12 126.5,13 127.17,13.68 IC3.15
  Top 0.61: IC3.15 133.68,13.68 138.5,18.5 138.5,19.5 137.5,20.5 137.5,25.5 136.5,25.5 C10.2 | 12VLED.A 117.53,24.97 v117.5,25 | v113.5,25 C17.2 103.5,25 103,25.5 IC2.2
  Bottom 0.61: v117.5,25 v113.5,25
  pour Top (isolate 0.254, no thermals): 148.5,34 140,34 140,26 135.5,26 135.5,25 153,25 153,34
24V
  Top 1.016: SUPPLY.2 141.69,44.69 | 141.69,44.69 C15.2 | IC1.2 138.87,43.37 140.19,44.69 141.69,44.69
AC1  (via drill 0.35)
  other vias: 42,77 43.5,77 43,76 43,75 42,75 42,76 45.5,83.5 45.5,84.5 46.5,84.5 47.5,84.5 47.5,83.5 46.5,83.5 45.5,88.5 45.5,89.5 46.5,89.5 47.5,89.5 47.5,88.5 46.5,88.5
  pour Top: 49,92 40.5,92 40.5,73.5 49,73.5
  pour Bottom: 49,92 40.5,92 40.5,73.5 49,73.5
AC2  (via drill 0.35)
  other vias: 43,5 43,6 42,6 43,4 42,4 42,5 54,5 54,6 53,6 54,4 53,4 53,5 59,5 59,6 58,6 59,4 58,4 58,5
  pour Top (isolate 0.813, rank 2): 62.5,8 40.5,8 40.5,-1 41,-1.5 62.5,-1.5
  pour Bottom: 62.5,8 40.5,8 40.5,-1.5 62.5,-1.5
BOOT
  Top 0.813: C9.2 135.5,41.5 136.09,42.09 IC1.1
COMP  (via drill 0.5)
  Top 0.406: TP1.1 128.78,4.22 IC3.9 127.95,5.23 R21.2 128.5,2 v129.5,1 | C23.2 110.5,19 v110.5,12
  Bottom 0.406: v110.5,12 110.5,3 112.5,1 v129.5,1
CSENSE  (via drill 0.4)
  Top 0.406: v127,68 127,71.5 127.5,72 R9.2 | v123.7,62.3 123.95,62.05 AT1.3
  Top 1.27: 130.5,72.03 R9.2
  Bottom 0.406: v127,68 123.5,64.5 123.5,62.3 v123.7,62.3
  pour Top (no thermals): 139,74 129,74 129,70 139,70
CT
  Top 0.406: IC3.5 115.92,9.87 R13.1 115.45,9.5 C12.2
DC+  (via drill 0.4)
  Top 0.406: R3.1 v97.5,64 | v97.5,80 C7.1
  Top 1.27: J3.1 133,77 133,78 139,78 139,76.5 133,76.5
  Bottom 0.406: v97.5,64 v97.5,80
  other vias: 51,17.5 61,17.5 61,10 51,10 51,13.5 61,13.5 52,10 53,10 54,10 55,10 60,10 51,11 51,12 51,14.5 51,15.5 51,16.5 61,12 61,11 56,10 57,10 58,10 59,10 52,17.5 53,17.5 54,17.5 55,17.5 56,17.5 57,17.5 58,17.5 59,17.5 60,17.5 56,11 56,12 55,14.5 55,11 56,14.5 56,15.5 56,16.5 54,11 53,11 52,16.5 52,15.5 52,14.5 52,13.5 52,12 52,11 54,12 54,13.5 54,16.5 53,16.5 55,16.5 57,16.5 58,16.5 59,16.5 60,16.5 61,16.5 61,15.5 61,14.5 57,11 58,11 59,11 60,11 60,12 60,13.5 60,14.5 60,15.5 59,15.5 59,14.5 59,13.5 59,12 58,12 57,12 58,13.5 57,14.5 57,15.5 58,15.5 58,14.5 55,12 54,14.5 53,12 53,13.5 53,14.5 53,15.5 54,15.5 55,15.5 55,13.5 57,13.5 56,13.5 59,91.5 59,81.5 51.5,81.5 51.5,91.5 55,91.5 55,81.5 51.5,90.5 51.5,89.5 51.5,88.5 51.5,87.5 51.5,82.5 52.5,91.5 53.5,91.5 56,91.5 57,91.5 58,91.5 53.5,81.5 52.5,81.5 51.5,86.5 51.5,85.5 51.5,84.5 51.5,83.5 59,90.5 59,89.5 59,88.5 59,87.5 59,86.5 59,85.5 59,84.5 59,83.5 59,82.5 52.5,86.5 53.5,86.5 56,87.5 52.5,87.5 56,86.5 57,86.5 58,86.5 52.5,88.5 52.5,89.5 58,90.5 57,90.5 56,90.5 55,90.5 53.5,90.5 52.5,90.5 53.5,88.5 55,88.5 58,88.5 58,89.5 58,87.5 58,85.5 58,84.5 58,83.5 58,82.5 58,81.5 57,81.5 56,81.5 52.5,85.5 52.5,84.5 52.5,83.5 52.5,82.5 53.5,82.5 55,82.5 56,82.5 57,82.5 57,83.5 56,83.5 55,83.5 53.5,83.5 53.5,84.5 53.5,85.5 55,84.5 56,85.5 57,85.5 57,84.5 56,84.5 53.5,87.5 56,88.5 53.5,89.5 55,89.5 56,89.5 57,89.5 57,88.5 57,87.5 55,87.5 55,85.5 55,86.5
  pour Top: 100,92.62 79.5,92.62 79.5,80 132.5,80 132.5,76 139.5,76 139.5,108.5 129,108.5 129,93.5 101,93.62
  pour Top (isolate 0.406, rank 5, no thermals): 85,94.5 50.5,94.5 50.5,28.5 40.5,28.5 40.5,9 50.5,9 50.5,-8.5 73.5,-8.5 73.5,80 85,80
  pour Bottom (isolate 0.61, rank 6): 73.5,28.5 40.5,28.5 40.5,9 63.5,9 63.5,-1 73.5,-1
  pour Bottom: 100,94 50.5,94 50.5,48.5 74,48.5 74,80 100,80
DISCHARG
  Top 0.406: R13.2 119,7.55 IC3.7
FBEMITT
  Top 0.406: IC4.2 103.14,53.13 105.5,55.5 107.5,55.5 107.92,55.92 107.92,57 107.92,57.42 | 107.92,57.42 R10.1 108,57.58 108,59.5 107,60.5 C20.1 | OK2.3 116.27,60.23 115.5,61 111.5,61 107.92,57.42
GND  (via drill 0.35, 0.4, 0.45)
  Top 0.406: AT1.5 129.87,63 130.5,63.63 v130.5,65.5 124.64,65.5 124,64.86 124,63.63 124.64,63 AT1.2 122.75,63 121.75,62 118.5,62 | AT1.4 130.18,62.05 131.5,63.37 131.5,66 130.5,67 126.5,67 126,67.5 126,72 124,72 | v132.03,66.03 132.03,65.97 GND.1
  Top 0.61: 84,1.75 93.5,1.75 | PS1.3 105.93,39.08 105.01,40 105.01,40.21 105,40.22 105,40.5 104.72,40.5 104.71,40.51 104,40.51 104,45.55 C6.2
  Top 1.016: R9.1 124.53,74 124,74 124,72 124,70
  Bottom 0.406: v130.5,65.5 131.5,65.5 131.53,65.53 131.53,65.54 v132.03,66.03
  Bottom 0.61: LED1.K 134.27,84.77 v124.5,75
  other vias: 89,63 89,66 89,64.5 89,67.5 88.5,64 88.5,65.5 88.5,67 91,71.5 90,71.5 92,71.5 89,70.5 89,69.5 93,71.5 89,71.5 89,68.5 94,71.5 40.5,40.5 41.5,40.5 42.5,40.5 43.5,40.5 44.5,40.5 40.5,39.5 41.5,39.5 42.5,39.5 43.5,39.5 44.5,39.5 44.5,41.5 43.5,41.5 42.5,41.5 41.5,41.5 40.5,41.5 44.5,42.5 44.5,38.5 43.5,42.5 42.5,42.5 41.5,42.5 40.5,42.5 40.5,38.5 41.5,38.5 42.5,38.5 43.5,38.5 79,46.5 79,34.5 93,34.5 93,46.5 79,40.5 79,35.5 79,36.5 79,37.5 79,38.5 79,39.5 79,41.5 79,42.5 79,43.5 79,44.5 79,45.5 93,45.5 93,44.5 93,43.5 93,42.5 93,41.5 93,40.5 93,39.5 93,38.5 93,37.5 93,36.5 93,35.5 92,40.5 91,40.5 80,40.5 81,40.5 82,40.5 83,40.5 84,40.5 85,40.5 86,40.5 87,40.5 90,40.5 88,40.5 89,40.5 118.5,64.5 118.5,65.5 118.5,63.5 118.5,66.5 118.5,67.5 124.5,69 124.5,70 124.5,74 123.5,74 123.5,75 123.5,73 123.5,72 123.5,71 123.5,70 123.5,69 105,57.5 105,58.5 106,59 109.5,52.5 109.5,53.5 112.5,52.5 112.5,53.5 113.5,52.5 113.5,53.5
  pour Top (isolate 0.61): 75,77 75,-4 94.5,-4 94.5,77
  pour Bottom (isolate 0.406, rank 6): 149,76.5 75,76.5 75,47 40.5,47 40.5,34 75,34 75,-1 94,-1 94,44.5 100,44.5 100,40 119,40 119,68.5 149,68.67
  pour Top: 44.5,47 40.5,47 40.5,34 44.5,34
  pour Top (isolate 0.305, rank 3): 149.5,77 88,77 88,45 100.5,45 100.5,40.5 119,40.5 119,59 122,59 122,68 125,68 125,74 127,74 127,68 135,68 135,59 149.5,59
GNDA  (via drill 0.5)
  other vias: 132.5,20 141,20 131.5,5.5 126,8 126,9.5 126,6.5 132,10 131,10 132,11 131,11 124.5,6.5 124.5,8 124.5,9.5 124.5,14 111.5,13 111.5,15.5 106.5,21.5 120.5,2.5 120,4.5 117,3.5 115,5.5 113.5,5.5 133.5,3.5 128.5,28 128.5,29 130.5,29 130.5,28 129.5,28 129.5,29 127,29 127,28 127,27 128.5,27 129.5,27 130.5,27 127,30 133.5,43.5 130,43.5 130,44.5 133.5,44.5 134.5,43.5 134.5,44.5 135.5,43.5 135.5,44.5 135.5,47.5 134.5,47.5 136.5,47.5
  pour Top (rank 3): 165,54.5 123.5,54.5 123.5,35.5 123,35 100.5,35 100.5,-1.5 102.5,-3.5 165,-3.5 166.5,-2 166.5,53
  pour Bottom (rank 3): 160,54 158,54 157.5,54.5 122.5,54.5 122.5,35 100.5,35 100.5,-7 160,-7
HVDIVD
  Top 0.406: R3.2 R4.1
  Top 0.61: IC4.3 99.86,51.87 99,51 99,48.5 98.42,47.92 R4.1
ISO5V  (via drill 0.4)
  Top 0.406: R11.1 105.53,46.08 C6.1 105.45,48.47 R7.2 105.42,49.58 104.5,50.5 104.5,53 105.91,54.41 IC4.8 112.91,54.41 113.73,55.23 OK2.4 113.73,57.77 115,56.5 117,56.5 118,57.5 118,59.5 119,60.5 v124,60.5 | AT1.6 128.95,63.95 v129.5,64.5
  Top 0.61: C6.1 106.5,44.95 PS1.4
  Bottom 0.406: v124,60.5 128,64.5 v129.5,64.5
N$1
  Top 0.61: PWR.A 101.45,48.5 R7.1
N$4
  Top 0.406: OK1.1 116,43.04 R8.2
N$5
  Bottom 0.813: R6.2 LED1.A
N$6
  Top 0.61: OK1.2 OK2.1
N$8
  Top 0.406: C1.2 138.5,51 137.5,52 R1.1
N$10
  Top 0.406: AT1.1 126.61,63.95 127,63.56 127,61.38 127.39,61 133,61 CTEST.1
N$17
  Top 0.406: 12VLED.C 130.87,22.87 132.95,24.95 R18.2
N$18
  Top 0.406: R11.2 R14.1
  Top 0.61: IC4.5 107.91,50.59 110.58,47.92 R11.2
N$20  (via drill 0.4)
  Top 0.406: R15.2 102.92,55.42 IC4.1 101.81,54.5 v99.5,54.5 | R8.1 115.92,47 v114.5,47
  Bottom 0.406: v114.5,47 111,47 107,51 102,51 99.5,53.5 v99.5,54.5
N$21
  Top 0.406: IC4.6 IC4.7
N$22
  Top 0.406: R15.1 101,57.58 C20.2
N$25  (via drill 0.5)
  Top 0.406: R21.1 123.5,4.55 123.5,15 v124,15.5 | v111.5,17 C22.2
  Bottom 0.406: v124,15.5 124,16.5 123.5,17 v111.5,17
NONINV
  Top 0.406: R22.2 104.54,11 115,11 C21.1 116.17,13.68 IC3.2 120.67,13.68 121.5,14.5 121.5,15.5 120,17 120,17.5 | R19.2 120,17.5 | R17.2 122.45,19.45 121.5,18.5 121.5,18 121,17.5 120,17.5
  Bottom 0.406: PAD1.1 101.5,5.5 101.5,10 103.04,11.54 R22.2
OPTEMITT
  Top 0.406: IC3.1 118.67,15.5 R20.1 115,15.55 C22.1 C23.1
  Top 0.61: C23.1 115,27.5 113.5,29 113.5,33 OK1.3
OSCOUT
  Top 0.406: TP6.1 122.5,10.5 121.86,11.13 IC3.4
OUT1
  Top 0.406: IC3.11 137.59,8.6 142.73,13.73 J5.2 143.96,13.73 J2.2
  Bottom 0.406: J2.4 145.54,11.19 J5.2
OUT2
  Top 0.406: IC3.14 136.91,12.4 140.77,16.27 J5.1 143.96,16.27 J2.1
  Bottom 0.406: J5.1 143.96,16.27 J2.3
PRIM1  (via drill 0.45)
  Top 2.54: T1.9 T1.10 T1.11 T1.12
  other vias: 22,38.5 23,38.5 24,38.5 25,38.5 26,38.5 27,38.5 28,38.5 29,38.5 30,38.5 31,38.5 32,38.5 33,38.5 34,38.5 35,38.5 22,37.5 23,37.5 24,37.5 25,37.5 26,37.5 27,37.5 28,37.5 29,37.5 30,37.5 31,37.5 32,37.5 33,37.5 34,37.5 35,37.5 22,39.5 23,39.5 24,39.5 25,39.5 26,39.5 27,39.5 28,39.5 29,39.5 30,39.5 31,39.5 32,39.5 33,39.5 34,39.5 35,39.5 10.5,46.5 10.5,47.5 10.5,48.5 11.5,46.5 11.5,47.5 11.5,48.5 9.5,46.5 9.5,47.5 9.5,48.5 13.5,46.5 13.5,47.5 13.5,48.5 14.5,46.5 14.5,47.5 14.5,48.5 12.5,46.5 12.5,47.5 12.5,48.5 15.5,46.5 15.5,47.5 15.5,48.5 16.5,46.5 16.5,47.5 16.5,48.5 26,49 26,50 26,51 27,49 27,50 27,51 25,49 25,50 25,51 29,49 29,50 29,51 30,49 30,50 30,51 28,49 28,50 28,51 31,49 31,50 31,51 32,49 32,50 32,51
  pour Top (isolate 0.406): -2.5,46 36,46 36,92.5 -2.5,92.5
  pour Top: 36,40 21.5,40 21.5,34.5 36,34.5
  pour Bottom: 36,51.5 8.5,51.5 8.5,34.5 36,34.5
PRIM2
  Top 2.54: T2.3 T2.4 34.5,42 30.5,42 | T2.2 T2.1 22.5,42 26.5,42 | 26.5,42 30.5,42 | T2.3 T2.2 | 26.5,42 T2.2 | 30.5,42 T2.3
  pour Top (isolate 0.305, rank 3): -2.5,0.5 36,0.5 36,43 -2.5,43
RT  (via drill 0.5)
  Top 0.406: R12.1 v112,4.5 | v121.5,8.5 121.41,8.6 IC3.6
  Bottom 0.406: v112,4.5 117.5,4.5 v121.5,8.5
SHUTDOWN
  Top 0.406: IC3.10 136.68,7.33 138,6 138,2 137.5,1.5 TP4.1
SOFTSTART
  Top 0.406: C16.2 119,5.83 IC3.8
SWITCH
  pour Top (isolate 0.254, no thermals): 136.5,36.5 134,36.5 134,42 130,42 130,36.5 128,36.5 128,34 132.5,34 132.5,30 136.5,30
SYNC  (via drill 0.5)
  Top 0.406: TP5.1 115.25,4.25 v117,6 | v117,11 117,12 117.41,12.4 IC3.3
  Bottom 0.406: v117,6 v117,11
TPCOMP
  Top 0.406: IC1.6 132.63,44.63 133.5,45.5 133.5,47 133,47.5 132,47.5 C5.2 132,51.92 R1.2
TPSS  (via drill 0.35)
  Top 0.406: IC1.4 138.41,45.91 v138.5,46 | v129.5,48 C4.2
  Bottom 0.406: v138.5,46 131.5,46 v129.5,48
VREF  (via drill 0.5)
  Top 0.406: TP7.1 135,17 132.94,14.95 IC3.16 127.56,14.95 126,16.5 | 126,16.5 C14.2 125.95,17.55 R17.1 v123,16 | OK1.4 116.27,23.73 118,22 v123,22 | v125.5,15.5 126,16 126,16.5
  Bottom 0.406: R22.3 121.08,14.08 v123,16 | v125.5,15.5 124.53,16.47 124.53,16.72 123,18.25 v123,22
VSEN
  Top 0.406: IC1.5 131.69,46 127,46 126.08,45.08 R2.1 R5.1

### Text on the board
tNames: BLEEDER | HV | V+ | WARNING, MAY GET TOASTY | GND | 1V = 1A | WARNING HV | VCC | GND | trns rights | 12V | GND | VREF | OUT1 | OUT2 | OSCOUT | GND | SYNC | SHUTDOWN